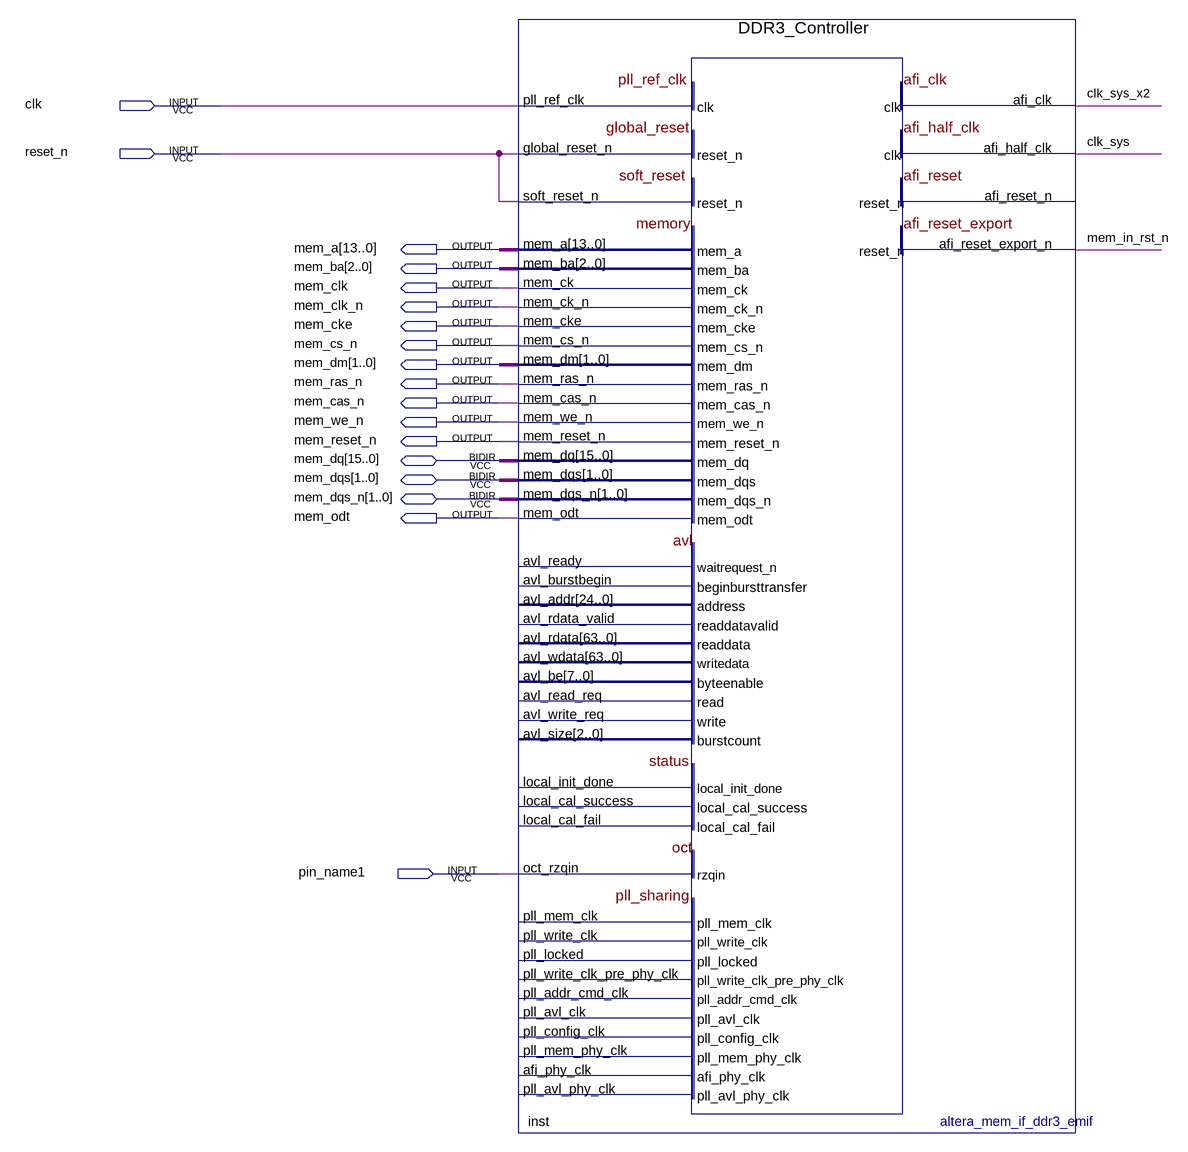
[diagram p0: schematic sheet]
// Quartus schematic DDR3_test.bdf as structural Verilog: 1 symbols, 18 pins
module DDR3_test (
  input  clk,
  input  reset_n,
  input  pin_name1,
  inout  [15:0] mem_dq,
  inout  [1:0] mem_dqs,
  inout  [1:0] mem_dqs_n,
  output [13:0] mem_a,
  output [2:0] mem_ba,
  output mem_clk,
  output mem_clk_n,
  output mem_cke,
  output mem_cs_n,
  output [1:0] mem_dm,
  output mem_ras_n,
  output mem_cas_n,
  output mem_we_n,
  output mem_reset_n,
  output mem_odt
);

  wire clk_sys, clk_sys_x2, mem_in_rst_n;

  DDR3_Controller inst (
    .pll_ref_clk(clk), .global_reset_n(reset_n), .soft_reset_n(reset_n), .oct_rzqin(pin_name1),
    .afi_clk(clk_sys_x2), .afi_half_clk(clk_sys), .afi_reset_export_n(mem_in_rst_n), .mem_a(mem_a),
    .mem_ba(mem_ba), .mem_ck(mem_clk), .mem_ck_n(mem_clk_n), .mem_cke(mem_cke), .mem_cs_n(mem_cs_n),
    .mem_dm(mem_dm), .mem_ras_n(mem_ras_n), .mem_cas_n(mem_cas_n), .mem_we_n(mem_we_n),
    .mem_reset_n(mem_reset_n), .mem_odt(mem_odt), .mem_dq(mem_dq), .mem_dqs(mem_dqs), .mem_dqs_n(mem_dqs_n));  // open: avl_burstbegin, avl_addr, avl_wdata, avl_be, avl_read_req, avl_write_req, avl_size, afi_reset_n, avl_ready, avl_rdata_valid, avl_rdata, local_init_done, local_cal_success, local_cal_fail, pll_mem_clk, pll_write_clk, pll_locked, pll_write_clk_pre_phy_clk, pll_addr_cmd_clk, pll_avl_clk, pll_config_clk, pll_mem_phy_clk, afi_phy_clk, pll_avl_phy_clk
endmodule
